# EAGLE design relayboard (EAGLE 6.4)
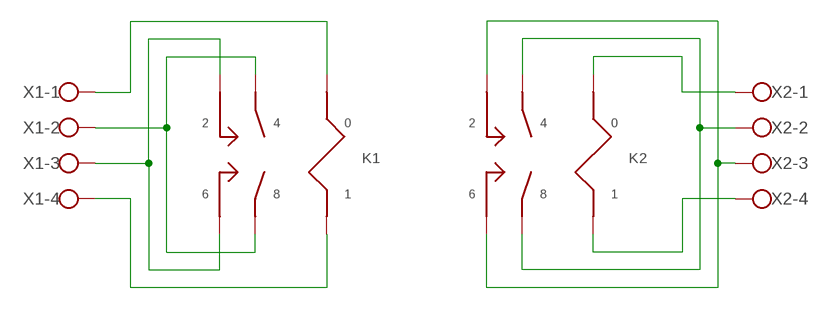
[diagram p0: schematic, sheet 1]

## Parts
K1  T92S7D12-24  [T92]
K2  T92S7D12-24  [T92]
X1  W237-4  [W237-4]
X2  W237-4  [W237-4]

## Nets
N$1: K1.P$9 K1.P$10 X1.1
N$2: K1.P$11 K1.P$12 X1.4
N$3: K1.P$1 K1.P$2 K1.P$5 K1.P$6 X1.3
N$4: K1.P$3 K1.P$4 K1.P$7 K1.P$8 X1.2
N$5: K2.P$9 K2.P$10 X2.1
N$6: K2.P$11 K2.P$12 X2.4
N$7: K2.P$3 K2.P$4 K2.P$7 K2.P$8 X2.2
N$8: K2.P$1 K2.P$2 K2.P$5 K2.P$6 X2.3

## Library data of the parts
K1 K2 = custom:T92S7D12-24
X1 X2 = con-wago-500:W237-4: WAGO SCREW CLAMP; OC_FARNELL: unknown; OC_NEWARK: unknown

## Board
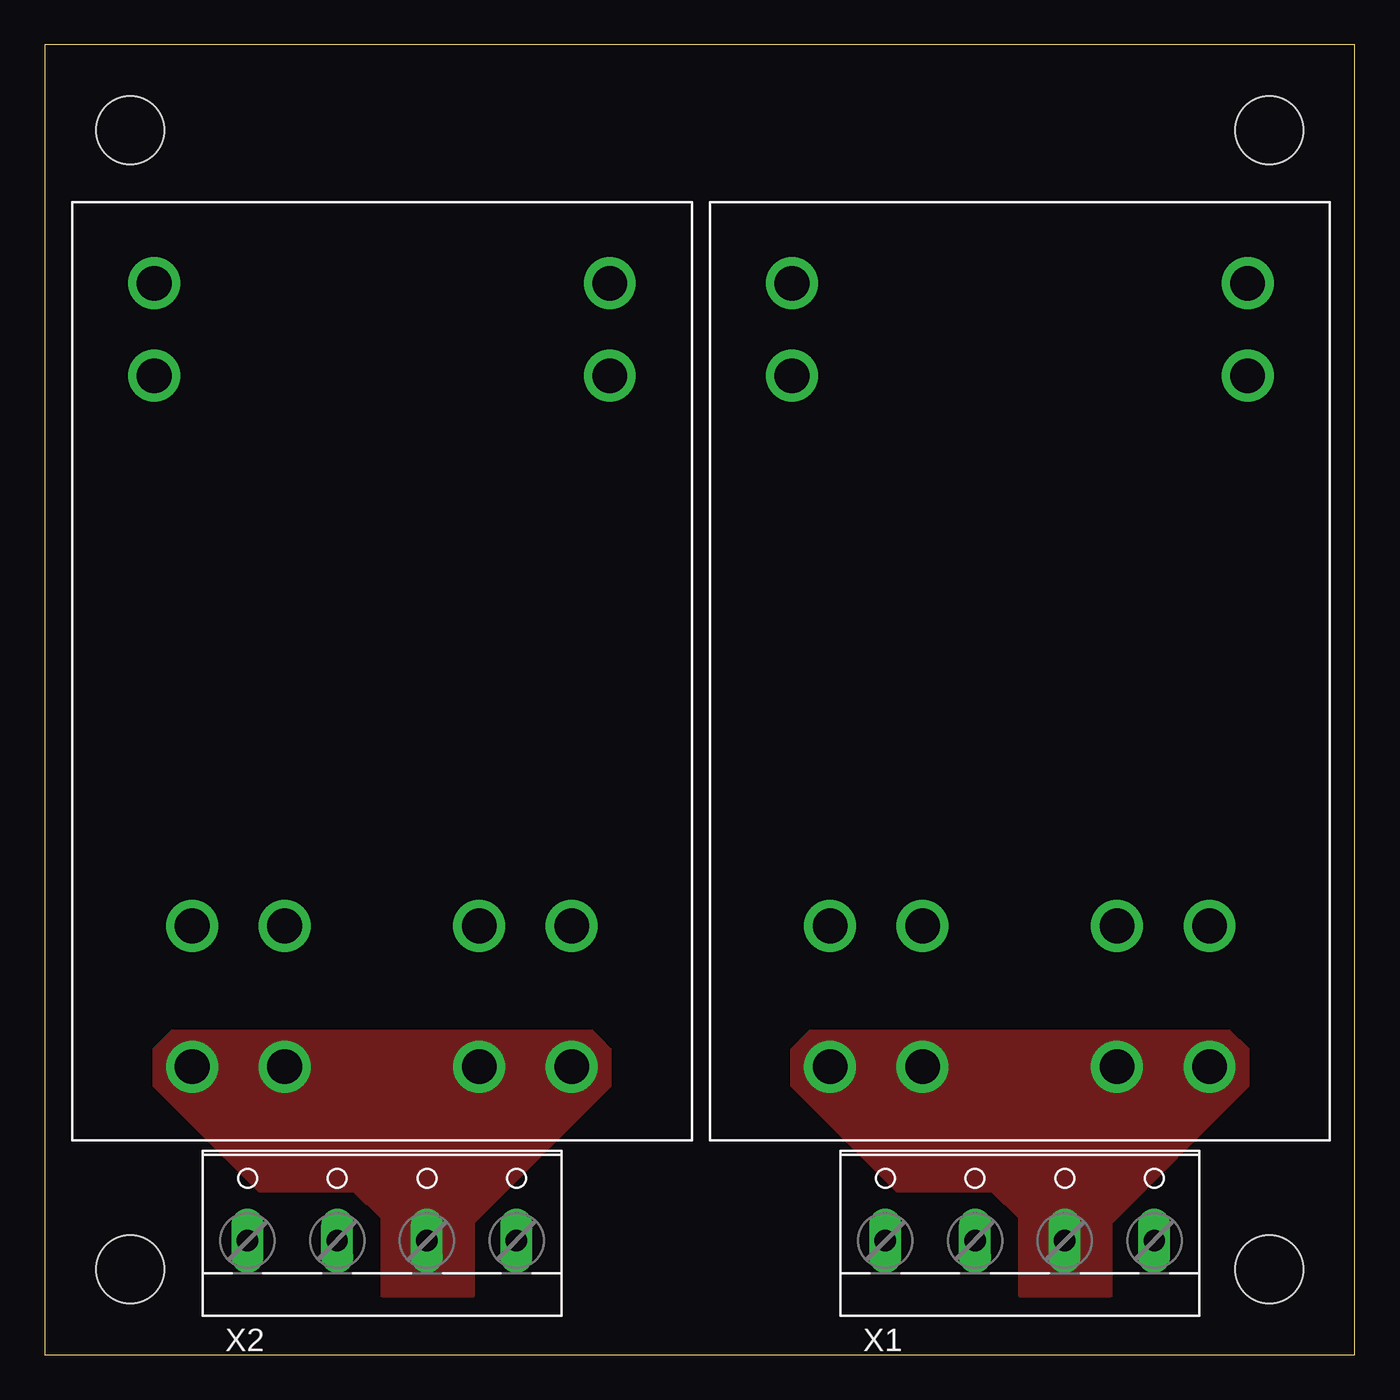
[diagram p1: board, top side]
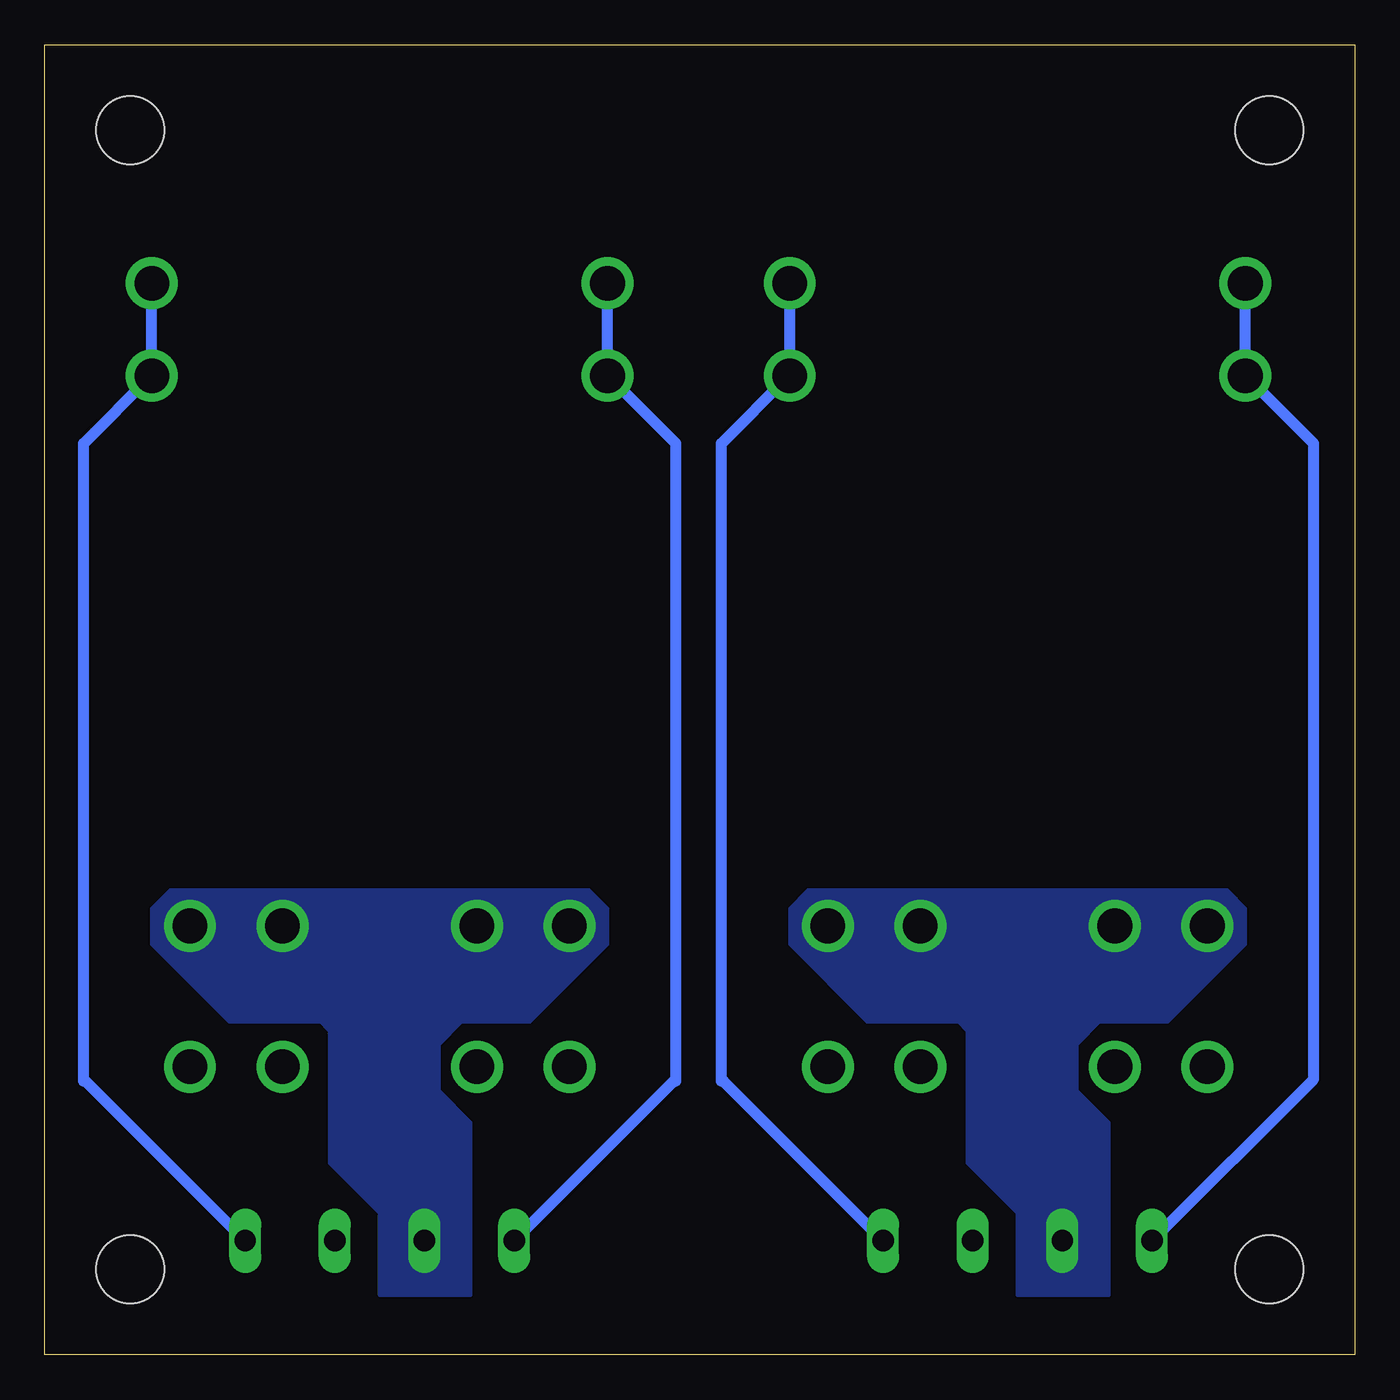
[diagram p2: board, bottom side, seen from below]

Size 73.03 x 73.03 mm. Coordinates in mm from the lower left corner, seen from the top.
Outline: 0,0 73.03,0 73.03,73.03 0,73.03 0,0
Copper layers (1*16): Top 0.035mm / dielectric 1.5mm / Bottom 0.035mm
Design rules "default": minimum track width 10mil, minimum drill 24mil, track to track 8mil, track to pad 8mil, pad to pad 8mil, via to via 8mil, smd to smd 8mil, copper to edge 40mil, drill to drill 8mil, minimum pad ring 10mil, minimum via ring 8mil, stop-mask expansion 4mil, vias tented up to drill 0mil, thermal gap 10mil
Holes 3.8 mm at 4.76,68.26 68.26,68.26 4.76,4.76 68.26,4.76

### Footprints (pad centres in the part's own frame; a part is rotated, then mirrored left to right if it is on the bottom)
T92 = drill 1.93: P$1 -41.097,10.579; P$2 -41.097,5.423; P$3 -33.249,10.579; P$4 -33.249,5.423; P$5 -41.097,-5.423; P$6 -41.097,-10.579; P$7 -33.249,-5.423; P$8 -33.249,-10.579; P$9 -2.578,12.7; P$10 2.578,12.7; P$11 -2.578,-12.7; P$12 2.578,-12.7
W237-4 = drill 1.194 long: 1 -7.5,-1.27; 2 -2.5,-1.27; 3 2.5,-1.27; 4 7.5,-1.27

### Placement (x,y rotation side)
K1  54.36,57.15 90 top
K2  18.8,57.15 90 top
X1  54.36,7.62 0 top
X2  18.8,7.62 0 top

### Tracks (layer width: path | path; a pad name or v marks a point on that pad's centre or on a via)
N$1
  Bottom 0.61: X1.1 37.97,15.24 37.85,15.24 37.85,50.8 41.62,54.57 K1.P$9 K1.P$10
N$2
  Bottom 0.61: X1.4 70.75,15.24 70.87,15.24 70.87,50.8 67.09,54.57 K1.P$11 K1.P$12
N$3
  pour Top (no thermals): 54.36,7.62 54.36,3.3 59.44,3.3 59.44,7.37 67.06,14.99 67.06,17.02 66.04,18.03 42.67,18.03 41.66,17.02 41.66,14.99 47.5,9.14 52.83,9.14
N$4
  pour Bottom (no thermals): 42.67,25.91 66.04,25.91 67.06,24.89 67.06,22.86 62.74,18.54 57.66,18.54 57.15,18.03 57.15,10.67 54.36,7.87 54.36,3.3 49.28,3.3 49.28,12.95 51.05,14.73 51.05,17.27 49.78,18.54 45.97,18.54 41.66,22.86 41.66,24.89
N$5
  Bottom 0.61: X2.1 2.29,15.36 2.29,50.8 6.1,54.61 | K2.P$9 6.1,54.61 | 6.1,54.61 K2.P$10
N$6
  Bottom 0.61: X2.4 35.19,15.24 35.31,15.24 35.31,50.8 31.53,54.57 K2.P$11 K2.P$12
N$7
  pour Bottom (no thermals): 7.11,25.91 30.48,25.91 31.5,24.89 31.5,22.86 27.18,18.54 22.1,18.54 21.59,18.03 21.59,10.67 18.8,7.87 18.8,3.3 13.72,3.3 13.72,12.95 15.49,14.73 15.49,17.27 14.22,18.54 10.41,18.54 6.1,22.86 6.1,24.89
N$8
  pour Top (no thermals): 18.8,7.62 18.8,3.3 23.88,3.3 23.88,7.37 31.5,14.99 31.5,17.02 30.48,18.03 7.11,18.03 6.1,17.02 6.1,14.99 11.94,9.14 17.27,9.14